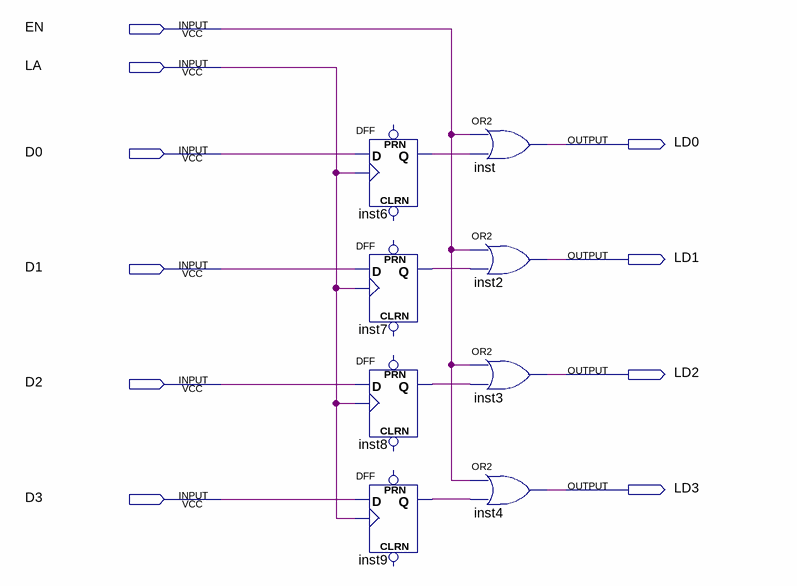
[diagram p0: schematic sheet]
// Quartus schematic 4latchedge0.bdf as structural Verilog: 8 symbols, 10 pins
module \4latchedge0  (
  input  EN,
  input  LA,
  input  D0,
  input  D1,
  input  D2,
  input  D3,
  output LD0,
  output LD1,
  output LD2,
  output LD3
);

  wire inst6_q, inst7_q, inst8_q, inst9_q;

  DFF inst6 (.CLK(LA), .D(D0), .Q(inst6_q));  // open: CLRN, PRN
  DFF inst7 (.CLK(LA), .D(D1), .Q(inst7_q));  // open: CLRN, PRN
  DFF inst8 (.CLK(LA), .D(D2), .Q(inst8_q));  // open: CLRN, PRN
  DFF inst9 (.CLK(LA), .D(D3), .Q(inst9_q));  // open: CLRN, PRN
  or inst (LD0, EN, inst6_q);
  or inst2 (LD1, EN, inst7_q);
  or inst3 (LD2, EN, inst8_q);
  or inst4 (LD3, EN, inst9_q);
endmodule
